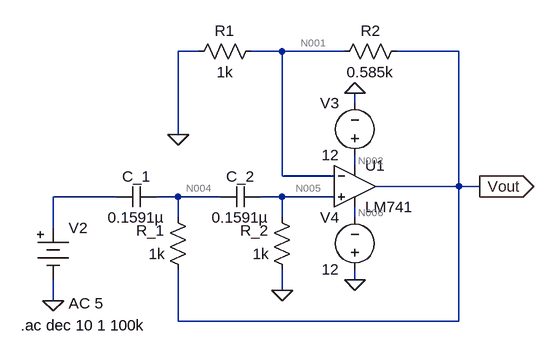
[diagram p0: schematic Draft2.asc]
Draft2.asc, the LTspice schematic file:
Version 4
SHEET 1 1036 680
WIRE -16 -48 -48 -48
WIRE 112 -48 64 -48
WIRE 208 -48 112 -48
WIRE 384 -48 288 -48
WIRE 224 32 224 16
WIRE -48 80 -48 -48
WIRE 224 128 224 112
WIRE 112 144 112 -48
WIRE 192 144 112 144
WIRE 384 160 384 -48
WIRE 384 160 256 160
WIRE 416 160 384 160
WIRE -144 176 -240 176
WIRE -48 176 -80 176
WIRE 16 176 -48 176
WIRE 112 176 80 176
WIRE 192 176 112 176
WIRE -48 208 -48 176
WIRE 112 208 112 176
WIRE 224 208 224 192
WIRE -240 224 -240 176
WIRE 224 304 224 288
WIRE 112 320 112 288
WIRE -240 336 -240 304
WIRE -48 368 -48 288
WIRE 384 368 384 160
WIRE 384 368 -48 368
FLAG 112 320 0
FLAG -48 80 0
FLAG 416 160 Vout
IOPIN 416 160 Out
FLAG 224 16 0
FLAG 224 304 0
FLAG -240 336 0
SYMBOL OpAmps\\LM741 224 96 R0
SYMATTR InstName U1
SYMBOL cap 16 192 R270
WINDOW 0 32 32 VTop 2
WINDOW 3 0 32 VBottom 2
SYMATTR InstName C_2
SYMATTR Value 0.1591µ
SYMBOL res 128 304 R180
WINDOW 0 36 76 Left 2
WINDOW 3 36 40 Left 2
SYMATTR InstName R_2
SYMATTR Value 1k
SYMBOL cap -144 192 R270
WINDOW 0 32 32 VTop 2
WINDOW 3 0 32 VBottom 2
SYMATTR InstName C_1
SYMATTR Value 0.1591µ
SYMBOL res -32 304 R180
WINDOW 0 36 76 Left 2
WINDOW 3 36 40 Left 2
SYMATTR InstName R_1
SYMATTR Value 1k
SYMBOL res 80 -64 R90
WINDOW 0 0 56 VBottom 2
WINDOW 3 32 56 VTop 2
SYMATTR InstName R1
SYMATTR Value 1k
SYMBOL voltage 224 128 R180
WINDOW 0 24 96 Left 2
WINDOW 3 24 16 Left 2
WINDOW 123 0 0 Left 0
WINDOW 39 0 0 Left 0
SYMATTR InstName V3
SYMATTR Value 12
SYMBOL voltage 224 304 R180
WINDOW 0 24 96 Left 2
WINDOW 3 24 16 Left 2
WINDOW 123 0 0 Left 0
WINDOW 39 0 0 Left 0
SYMATTR InstName V4
SYMATTR Value 12
SYMBOL res 304 -64 R90
WINDOW 0 0 56 VBottom 2
WINDOW 3 32 56 VTop 2
SYMATTR InstName R2
SYMATTR Value 0.585k
SYMBOL Misc\\battery -240 208 R0
WINDOW 123 24 132 Left 2
WINDOW 39 0 0 Left 0
SYMATTR InstName V2
SYMATTR Value ""
SYMATTR Value2 AC 5
TEXT -290 374 Left 2 !.ac dec 10 1 100k

The netlist it stands for:
* Draft2.asc
XU1 N005 N001 N002 N006 Vout LM741  ; pins In+ In- V+ V- OUT
C_2 N004 N005 0.1591µ
R_2 0 N005 1k
C_1 N003 N004 0.1591µ
R_1 Vout N004 1k
R1 N001 0 1k
V3 N002 0 12
V4 0 N006 12
R2 Vout N001 0.585k
V2 N003 0 AC 5
.ac dec 10 1 100k
.lib LM741.lib
.backanno
.end

* Results of the author's LTspice run, read from the files saved beside the schematic
* Operating Point, zero values left out:
*   V(n001) = 942.1 µV
*   V(n005) = -57.86 µV
*   V(n006) = -12 V
*   V(n002) = 12 V
*   V(vout) = 1.553 mV
*   V(n004) = 1.553 mV
*   I(R2) = 1.044 µA
*   I(R1) = 942.1 nA
*   I(R_2) = 57.86 nA
*   I(V4) = -1.626 mA
*   I(V3) = -1.627 mA
*   Ix(u1:1) = 57.86 nA
*   Ix(u1:2) = 101.9 nA
*   Ix(u1:99) = 1.627 mA
*   Ix(u1:50) = -1.626 mA
*   Ix(u1:28) = -1.044 µA
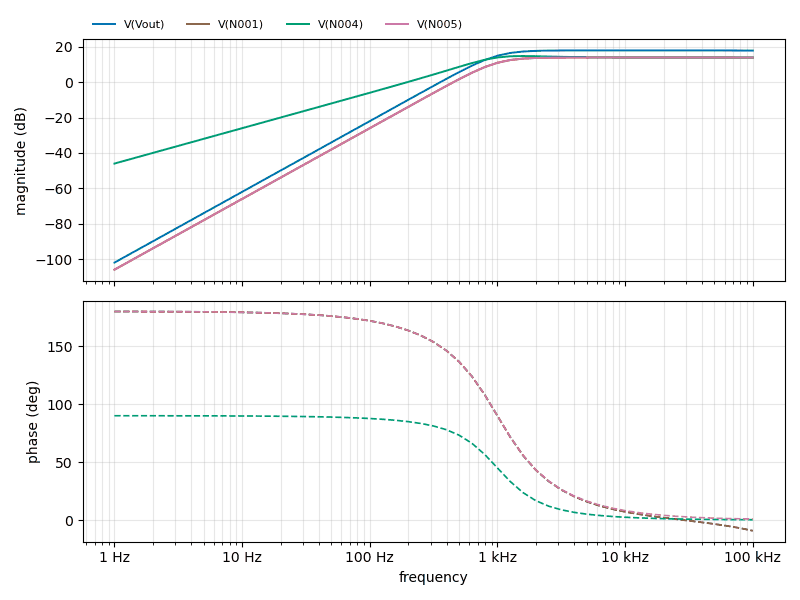
[diagram p1: AC Analysis of Draft2.asc, plotted from the saved traces]
* AC Analysis, 1 run:
*   V(Vout): -102.02 dB at 1 Hz, 17.86 dB at 100 kHz, peak 17.96 dB at 10 kHz, 3 dB below the peak at 998.1 Hz
*   V(N001): -106.02 dB at 1 Hz, 13.86 dB at 100 kHz, peak 13.96 dB at 10 kHz, 3 dB below the peak at 998.1 Hz
*   V(N004): -46.02 dB at 1 Hz, 13.96 dB at 100 kHz, peak 14.78 dB at 1.585 kHz, 3 dB below the peak at 712.3 Hz
*   V(N005): -106.03 dB at 1 Hz, 13.96 dB at 100 kHz, peak 13.96 dB at 100 kHz, 3 dB below the peak at 998.3 Hz